# Altium schematic sheet simbolos.SchDoc
size A4
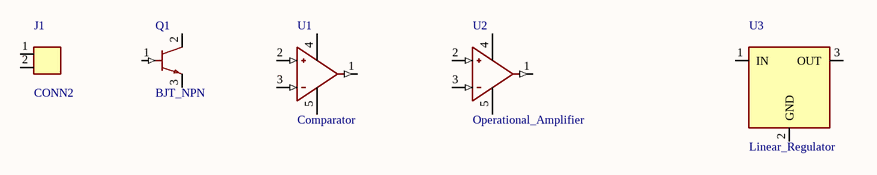
[diagram p0: simbolos.SchDoc]

## Parts
J1  CONN2
Q1  BJT_NPN
U1  Comparator
U2  Operational_Amplifier
U3  Linear_Regulator

## Nets

Not connected (* = marked no-connect by the designer): J1 1 2; Q1 1(B) 2(C) 3(E); U1 1 2(+) 3(-) 4(V+) 5(V-); U2 1 2(+) 3(-) 4(V+) 5(V-); U3 1(IN) 2(GND) 3(OUT)